# EAGLE design ADXL_ADXRS Breakout Pod RevB (EAGLE 9.6.2)
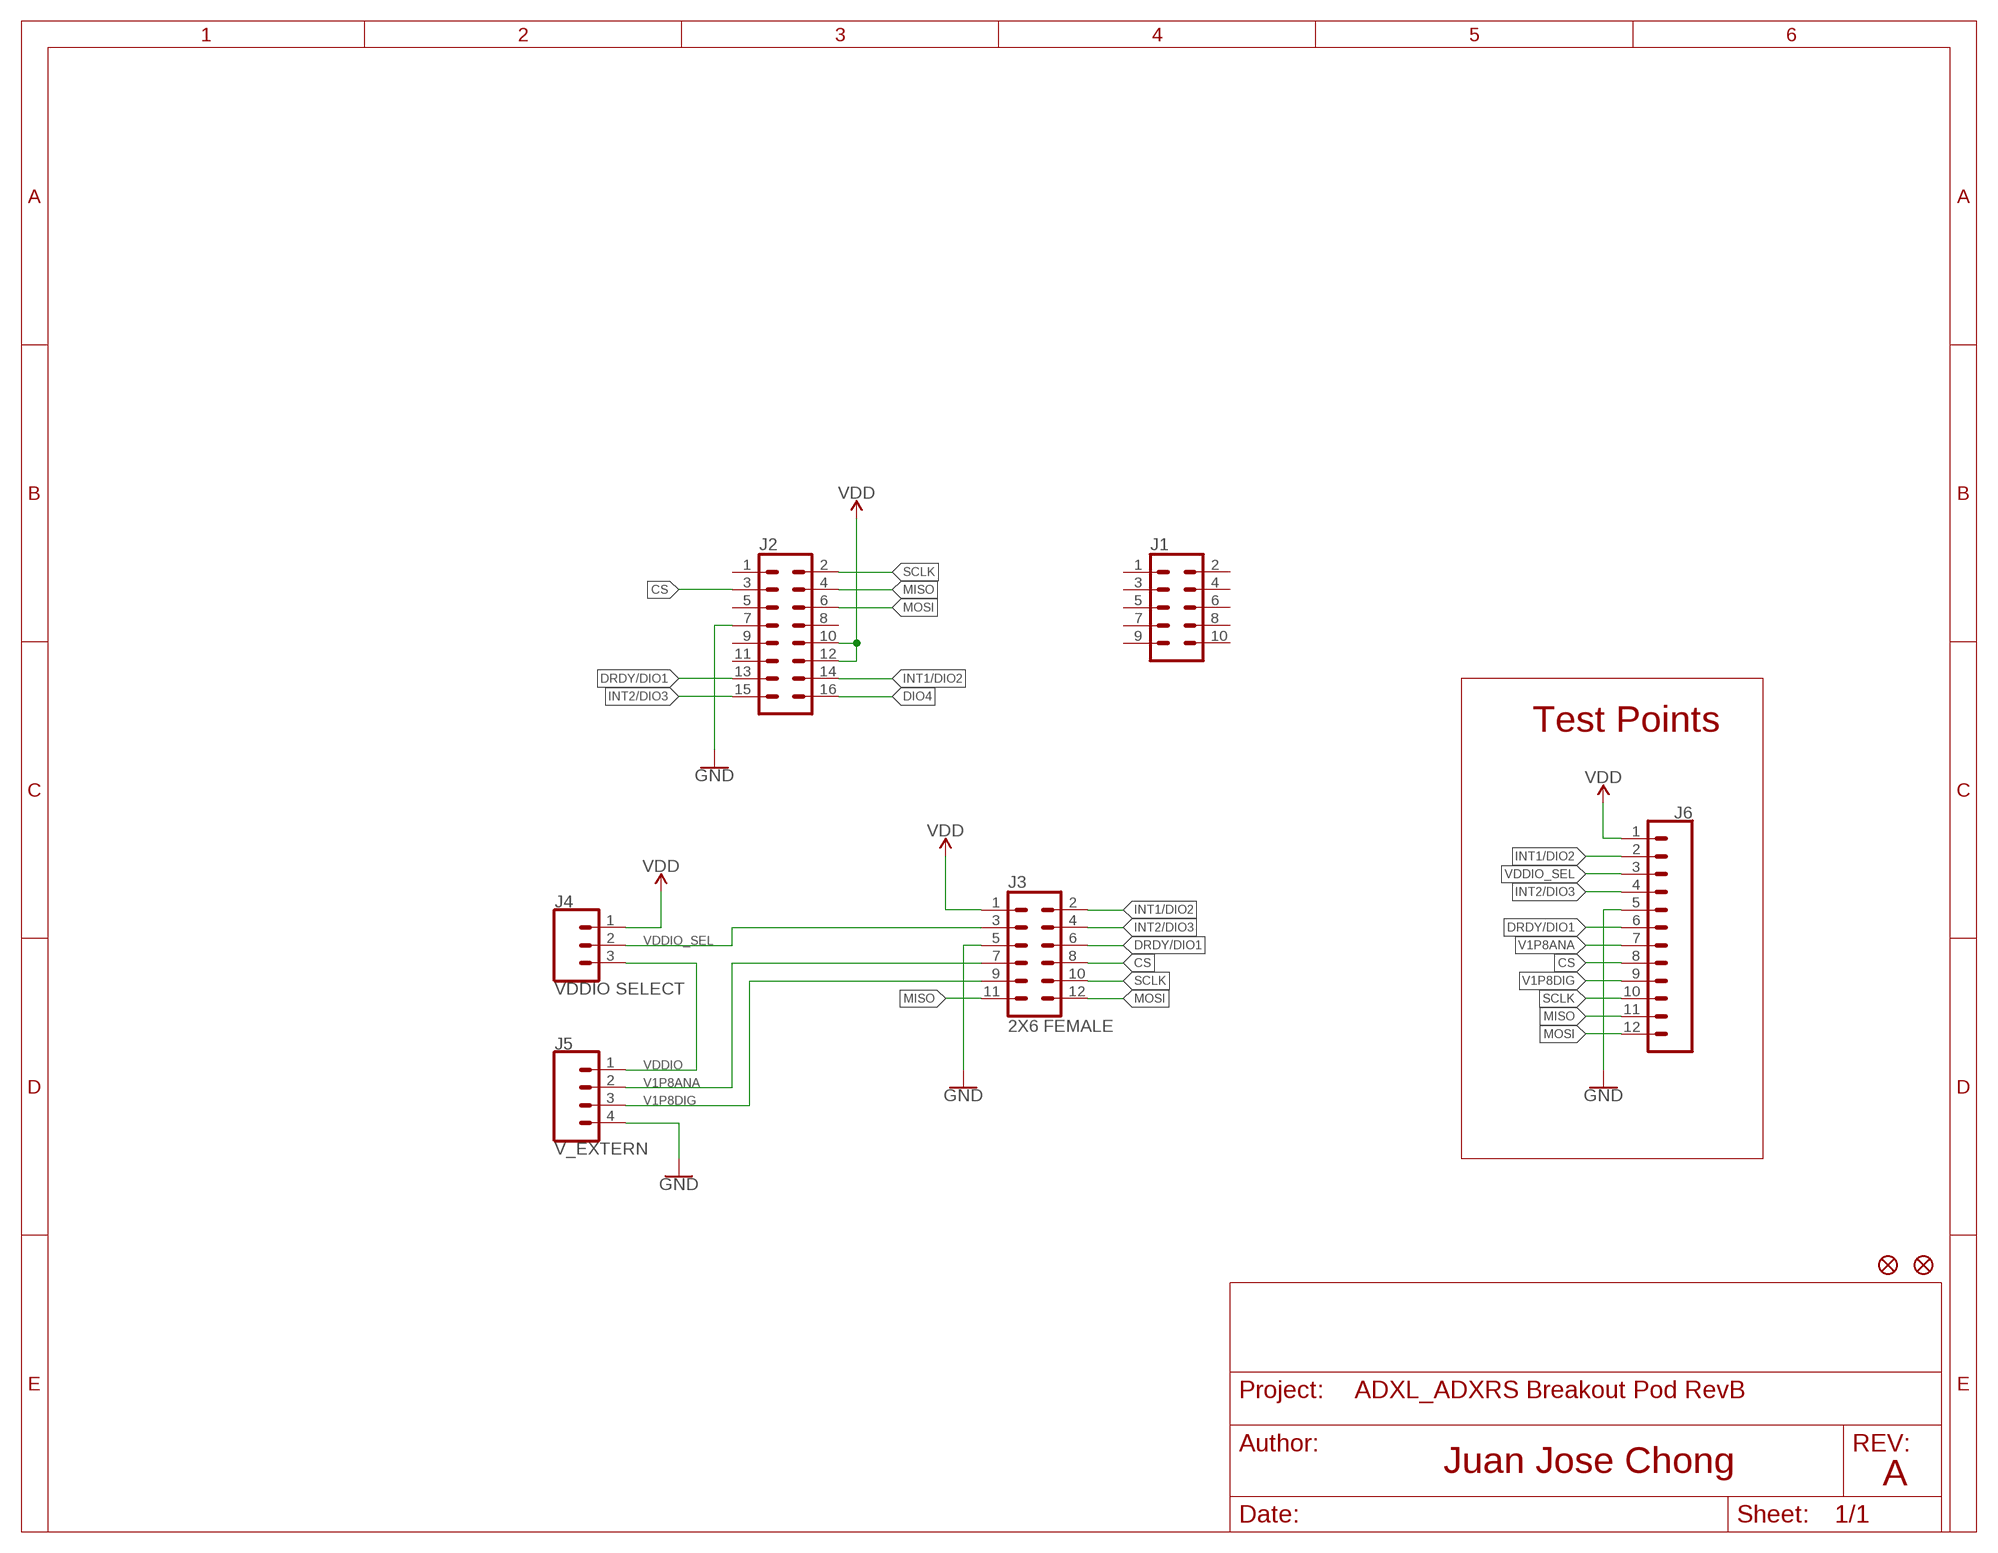
[diagram p0: schematic, sheet 1]

## Parts
FD1  FIDUCIAL1X2  [FIDUCIAL-1X2]
FD2  FIDUCIAL1X2  [FIDUCIAL-1X2]
J1  CONN_05X2_2MM_FEMALE  [M22-6550542R]
J2  CONN_08X2_2MM_FEMALE  [M22-6550842R]
J3  2X6 FEMALE  CONN_06X2PTH_FEMALE  [2X6]
J4  VDDIO SELECT  CONN_03  [1X03]
J5  V_EXTERN  CONN_04PTH  [1X04]
J6  CONN_12  [1X12]

## Nets
CS: J2.3 J3.8 J6.8
DIO4: J2.16
DRDY/DIO1: J2.13 J3.6 J6.6
GND: J2.7 J3.5 J5.4 J6.5
INT1/DIO2: J2.14 J3.2 J6.2
INT2/DIO3: J2.15 J3.4 J6.4
MISO: J2.4 J3.11 J6.11
MOSI: J2.6 J3.12 J6.12
SCLK: J2.2 J3.10 J6.10
V1P8ANA: J3.7 J5.2 J6.7
V1P8DIG: J3.9 J5.3 J6.9
VDD: J2.10 J2.12 J3.1 J4.1 J6.1
VDDIO: J4.3 J5.1
VDDIO_SEL: J3.3 J4.2 J6.3
Unconnected: J1.1 J1.2 J1.3 J1.4 J1.5 J1.6 J1.7 J1.8 J1.9 J1.10 J2.1 J2.5 J2.8 J2.9 J2.11

## Notes on the sheet
- Test Points
- A

## Library data of the parts
FD1 FD2 = SparkFun-Aesthetics:FIDUCIAL: Fiducial Alignment Points Point-of-reference for pick-and-place machines and other optical instruments.
J1 = ADI_iSensors_Misc:CONN_05X2: Multi connection point. Often used as Generic Header-pin footprint for 0.1 inch spaced/style header connections For AVR SPI programming port, see special device with nice symbol: "AVR_SPI_PROG_5x2.dev" You can populate with any combo of single row headers, but if you'd like an exact match, check these: 2x5 AVR ICSP Male Header <https://www.sparkfun.com/products/778> (PRT-00778) 2x5 Pin Shrouded Header <https://www.sparkfun.com/products/8506> (PRT-08506) On any of the 0.1 inch spaced packages, you can populate with these: Break Away Headers - Straight <https://www.sparkfun.com/products/116> (PRT-00116) Break Away Male Headers - Right Angle <https://www.sparkfun.com/products/553> (PRT-00553) Female Headers <https://www.sparkfun.com/products/115> (PRT-00115) Break Away Headers - Machine Pin <https://www.sparkfun.com/products/117> (PRT-00117) Break Away Female Headers - Swiss Machine Pin <https://www.sparkfun.com/products/743> (PRT-00743) Special note: the shrouded connector mates well with our 5x2 ribbon cables: 2x5 Pin IDC Ribbon Cable <https://www.sparkfun.com/products/8535> (PRT-08535)
J2 = ADI_iSensors_Misc:CONN_08X2: Multi connection point. Often used as Generic Header-pin footprint for 0.1 inch spaced/style header connections You can populate with any combo of single row headers, but if you'd like an exact match, check this: Header - 2x8 (Male, 0.1") <https://www.sparkfun.com/products/13156> (PRT-13156) On any of the 0.1 inch spaced packages, you can populate with these: Break Away Headers - Straight <https://www.sparkfun.com/products/116> (PRT-00116) Break Away Male Headers - Right Angle <https://www.sparkfun.com/products/553> (PRT-00553) Female Headers <https://www.sparkfun.com/products/115> (PRT-00115) Break Away Headers - Machine Pin <https://www.sparkfun.com/products/117> (PRT-00117) Break Away Female Headers - Swiss Machine Pin <https://www.sparkfun.com/products/743> (PRT-00743)
J3 = SparkFun-Connectors:CONN_06X2: Multi connection point. Often used as Generic Header-pin footprint for 0.1 inch spaced/style header connections On any of the 0.1 inch spaced packages, you can populate with these: Break Away Headers - Straight <https://www.sparkfun.com/products/116> (PRT-00116) Break Away Male Headers - Right Angle <https://www.sparkfun.com/products/553> (PRT-00553) Female Headers <https://www.sparkfun.com/products/115> (PRT-00115) Break Away Headers - Machine Pin <https://www.sparkfun.com/products/117> (PRT-00117) Break Away Female Headers - Swiss Machine Pin <https://www.sparkfun.com/products/743> (PRT-00743); PROD_ID: CONN-12423
J4 = SparkFun-Connectors:CONN_03: Multi connection point. Often used as Generic Header-pin footprint for 0.1 inch spaced/style header connections On any of the 0.1 inch spaced packages, you can populate with these: Break Away Headers - Straight <https://www.sparkfun.com/products/116> (PRT-00116) Break Away Male Headers - Right Angle <https://www.sparkfun.com/products/553> (PRT-00553) Female Headers <https://www.sparkfun.com/products/115> (PRT-00115) Break Away Headers - Machine Pin <https://www.sparkfun.com/products/117> (PRT-00117) Break Away Female Headers - Swiss Machine Pin <https://www.sparkfun.com/products/743> (PRT-00743) Stackable Header - 3 Pin (Female, 0.1") <https://www.sparkfun.com/products/13875> (PRT-13875) For SCREWTERMINALS and SPRING TERMINALS visit here: Screw Terimnals on SparkFun.com <https://www.sparkfun.com/search/results?term=Screw+Terminals> (5mm/3.5mm/2.54mm spacing) This device is also useful as a general connection point to wire up your design to another part of your project. Our various solder wires solder well into these plated through hole pads. Hook-Up Wire - Assortment (Stranded, 22 AWG) <https://www.sparkfun.com/products/11375> (PRT-11375) Hook-Up Wire - Assortment (Solid Core, 22 AWG) <https://www.sparkfun.com/products/11367> (PRT-11367) View the entire wire category on our website here <https://www.sparkfun.com/categories/141> Special notes: Molex polarized connector foot print use with SKU : PRT-08232 with associated crimp pins and housings.; PROD_ID: XXX-00000; VALUE: 455-1750-1-ND
J5 = SparkFun-Connectors:CONN_04: Multi connection point. Often used as Generic Header-pin footprint for 0.1 inch spaced/style header connections On any of the 0.1 inch spaced packages, you can populate with these: Break Away Headers - Straight <https://www.sparkfun.com/products/116> (PRT-00116) Break Away Male Headers - Right Angle <https://www.sparkfun.com/products/553> (PRT-00553) Female Headers <https://www.sparkfun.com/products/115> (PRT-00115) Break Away Headers - Machine Pin <https://www.sparkfun.com/products/117> (PRT-00117) Break Away Female Headers - Swiss Machine Pin <https://www.sparkfun.com/products/743> (PRT-00743) For SCREWTERMINALS and SPRING TERMINALS visit here: Screw Terimnals on SparkFun.com <https://www.sparkfun.com/search/results?term=Screw+Terminals> (5mm/3.5mm/2.54mm spacing) This device is also useful as a general connection point to wire up your design to another part of your project. Our various solder wires solder well into these plated through hole pads. Hook-Up Wire - Assortment (Stranded, 22 AWG) <https://www.sparkfun.com/products/11375> (PRT-11375) Hook-Up Wire - Assortment (Solid Core, 22 AWG) <https://www.sparkfun.com/products/11367> (PRT-11367) View the entire wire category on our website here <https://www.sparkfun.com/categories/141> Special notes: Molex polarized connector foot print use with SKU : PRT-08231 with associated crimp pins and housings. 1MM SMD Version SKU: PRT-10208; PROD_ID: CONN-09696
J6 = SparkFun-Connectors:CONN_12: Multi connection point. Often used as Generic Header-pin footprint for 0.1 inch spaced/style header connections On any of the 0.1 inch spaced packages, you can populate with these: Break Away Headers - Straight <https://www.sparkfun.com/products/116> (PRT-00116) Break Away Male Headers - Right Angle <https://www.sparkfun.com/products/553> (PRT-00553) Female Headers <https://www.sparkfun.com/products/115> (PRT-00115) Break Away Headers - Machine Pin <https://www.sparkfun.com/products/117> (PRT-00117) Break Away Female Headers - Swiss Machine Pin <https://www.sparkfun.com/products/743> (PRT-00743) For SCREWTERMINALS and SPRING TERMINALS visit here: Screw Terimnals on SparkFun.com <https://www.sparkfun.com/search/results?term=Screw+Terminals> (5mm/3.5mm/2.54mm spacing) This device is also useful as a general connection point to wire up your design to another part of your project. Our various solder wires solder well into these plated through hole pads. Hook-Up Wire - Assortment (Stranded, 22 AWG) <https://www.sparkfun.com/products/11375> (PRT-11375) Hook-Up Wire - Assortment (Solid Core, 22 AWG) <https://www.sparkfun.com/products/11367> (PRT-11367) View the entire wire category on our website here <https://www.sparkfun.com/categories/141> Special notes: Molex polarized connector foot print use with SKU : PRT-08231 with associated crimp pins and housings. 1MM SMD Version SKU: PRT-10208 NOTES ON THE VARIANTS LOCK and LOCK_LONGPADS... This footprint was designed to help hold the alignment of a through-hole component (i.e. 6-pin header) while soldering it into place. You may notice that each hole has been shifted either up or down by 0.005 of an inch from it's more standard position (which is a perfectly straight line). This slight alteration caused the pins (the squares in the middle) to touch the edges of the holes. Because they are alternating, it causes a "brace" to hold the component in place. 0.005 has proven to be the perfect amount of "off-center" position when using our standard breakaway headers. Although looks a little odd when you look at the bare footprint, once you have a header in there, the alteration is very hard to notice. Also,if you push a header all the way into place, it is covered up entirely on the bottom side.

## Board
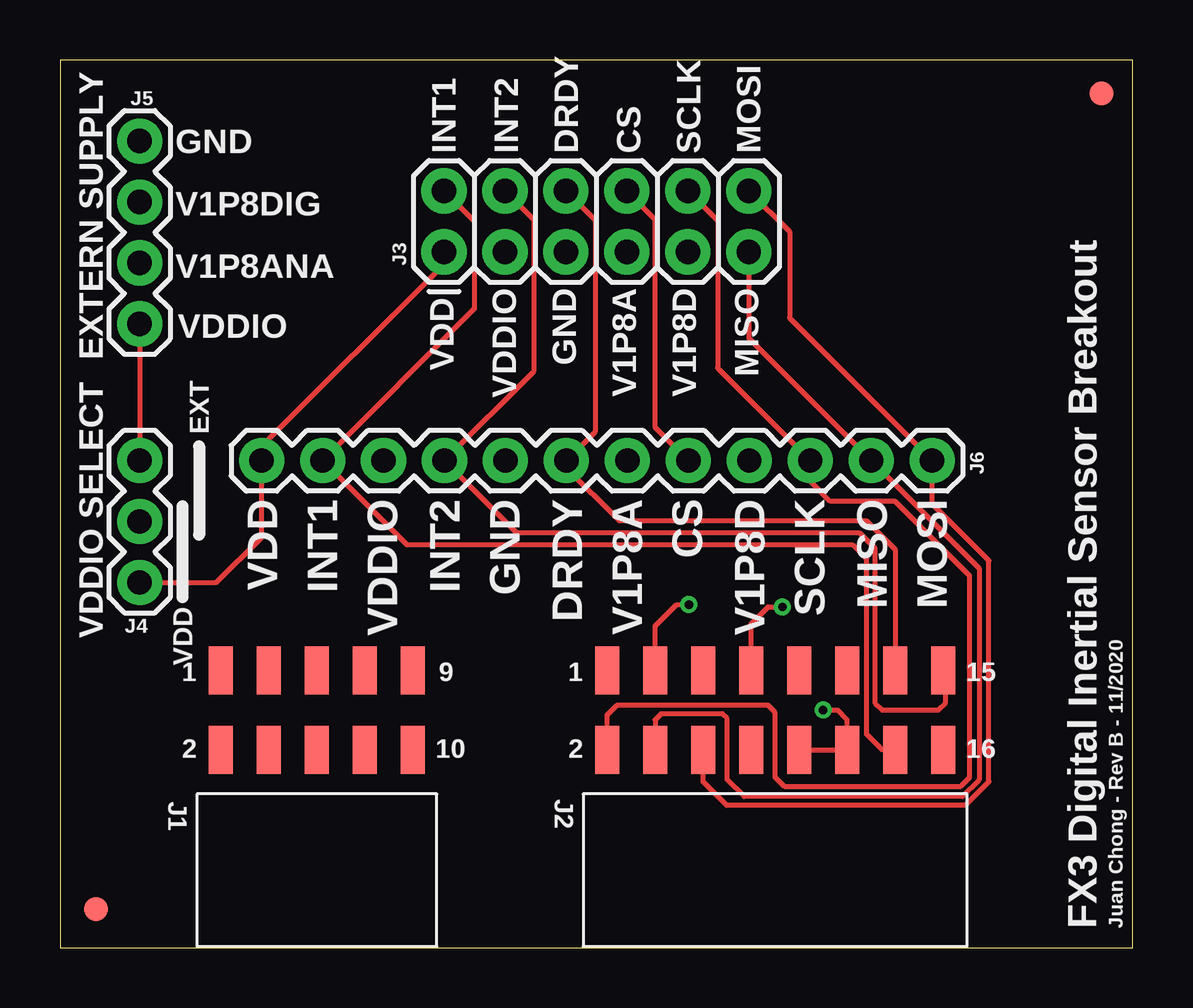
[diagram p1: board, top side]
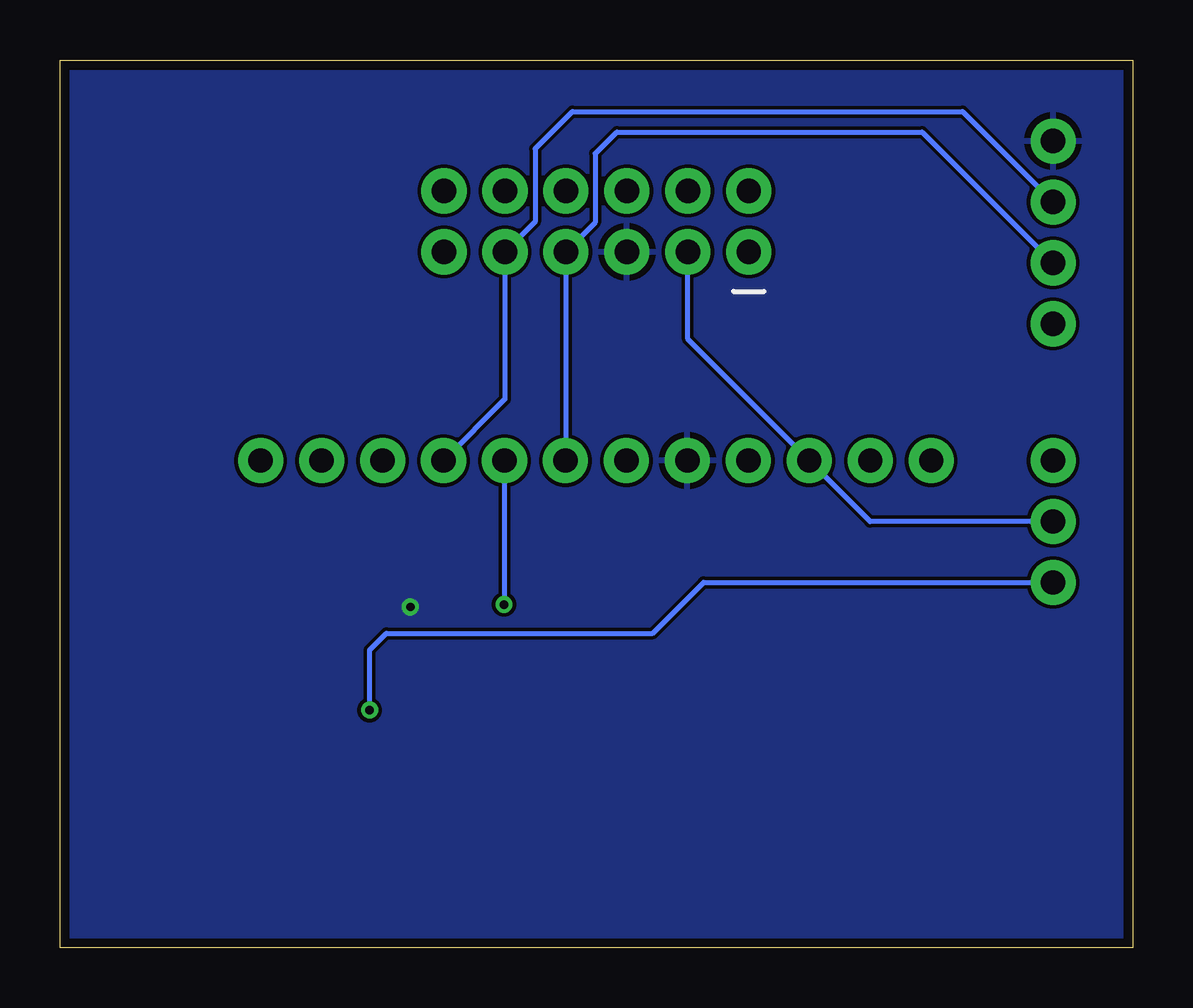
[diagram p2: board, bottom side, seen from below]

Size 44.7 x 37 mm. Coordinates in mm from the lower left corner, seen from the top.
Outline: 0,0 44.7,0 44.7,37 0,37 0,0
Copper layers (1*16): Top 0.0356mm / dielectric 1.5011mm / Bottom 0.0356mm
Design rules "LaenPCBOrder_FilledVias *": minimum track width 6mil, minimum drill 10mil, track to track 6mil, track to pad 6mil, pad to pad 6mil, via to via 6mil, smd to smd 6mil, copper to edge 15mil, drill to drill 6mil, minimum pad ring 7mil, minimum via ring 7mil, stop-mask expansion 4mil, vias tented up to drill 20mil, thermal gap 10mil

### Footprints (pad centres in the part's own frame; a part is rotated, then mirrored left to right if it is on the bottom)
FIDUCIAL-1X2 = smd 1 x 1: 1 0,0
M22-6550542R = smd 1 x 2: 1 4,-1.65; 2 4,1.65; 3 2,-1.65; 4 2,1.65; 5 0,-1.65; 6 0,1.65; 7 -2,-1.65; 8 -2,1.65; 9 -4,-1.65; 10 -4,1.65
M22-6550842R = smd 1 x 2: 1 7,-1.65; 2 7,1.65; 3 5,-1.65; 4 5,1.65; 5 3,-1.65; 6 3,1.65; 7 1,-1.65; 8 1,1.65; 9 -1,-1.65; 10 -1,1.65; 11 -3,-1.65; 12 -3,1.65; 13 -5,-1.65; 14 -5,1.65; 15 -7,-1.65; 16 -7,1.65
2X6 = drill 1.016 pad 1.88: 1 0,0; 2 0,2.54; 3 2.54,0; 4 2.54,2.54; 5 5.08,0; 6 5.08,2.54; 7 7.62,0; 8 7.62,2.54; 9 10.16,0; 10 10.16,2.54; 11 12.7,0; 12 12.7,2.54
1X03 = drill 1.016 pad 1.88: 1 0,0; 2 2.54,0; 3 5.08,0
1X04 = drill 1.016 pad 1.88: 1 0,0; 2 2.54,0; 3 5.08,0; 4 7.62,0
1X12 = drill 1.016 pad 1.88: 1 0,0; 2 2.54,0; 3 5.08,0; 4 7.62,0; 5 10.16,0; 6 12.7,0; 7 15.24,0; 8 17.78,0; 9 20.32,0; 10 22.86,0; 11 25.4,0; 12 27.94,0

### Placement (x,y rotation side)
FD1  1.5,1.6 0 top
FD2  43.4,35.6 0 top
J1  10.7,9.9 180 top
J2  29.8,9.9 180 top
J3  16,29 0 top
J4  3.32,15.22 90 top
J5  3.32,26 90 top
J6  8.4,20.3 0 top

### Tracks (layer width: path | path; a pad name or v marks a point on that pad's centre or on a via)
CS  (via drill 0.35)
  Top 0.2: J6.8 24.81,21.67 24.81,30.35 J3.8 | J2.3 24.8,13.4 25.7,14.3 v26.2,14.3
  Bottom 0.2: J6.8 26.18,14.32 v26.2,14.3
DRDY/DIO1
  Top 0.2: J3.6 22.3,30.32 22.3,21.5 J6.6 21.1,20 23.3,17.8 33.6,17.8 34.8,16.6 J2.13
GND  (via drill 0.35)
  Top 0.2: J2.7 28.8,13.5 29.5,14.2 v30.1,14.2
  Bottom 0.2: v30.1,14.2 29.9,14.4
  pour Bottom: -0.9,-1.1 45.1,-1.1 45.1,36.5 -0.9,36.5
INT1/DIO2
  Top 0.2: J3.2 17.27,30.27 17.27,26.63 J6.2 14.44,16.8 33,16.8 33.6,16.2 33.6,8.9 34.25,8.25 J2.14
INT2/DIO3
  Top 0.2: J3.4 19.73,30.35 19.73,24.01 J6.4 19.02,17.3 33.3,17.3 33.95,16.65 33.95,10.2 34.25,9.9 36.6,9.9 36.9,10.2 36.9,11.45 J2.15
MISO
  Top 0.2: J3.11 28.7,25.4 J6.11 38.3,15.8 38.3,7 37.6,6.3 28.5,6.3 27.8,7 27.8,9.55 27.6,9.75 25.05,9.75 24.8,9.5 J2.4
MOSI
  Top 0.2: J3.12 30.4,29.84 30.4,26.24 J6.12 36.34,18.5 38.71,16.13 38.71,6.91 37.75,5.95 27.75,5.95 26.8,6.9 J2.6
SCLK
  Top 0.2: J3.10 27.4,30.3 27.4,24.16 J6.10 31.26,19.44 32.1,18.6 34.8,18.6 37.9,15.5 37.9,7.1 37.5,6.7 30.2,6.7 29.8,7.1 29.8,9.8 29.5,10.1 23.2,10.1 22.8,9.7 J2.2
V1P8ANA
  Bottom 0.2: J6.7 23.62,20.32 J3.7 22.4,30.22 22.4,33.1 21.5,34 8.78,34 J5.2
V1P8DIG
  Bottom 0.2: J6.9 26.16,22.86 J3.9 24.9,30.26 24.9,33.3 23.35,34.85 7.09,34.85 J5.3
VDD  (via drill 0.35)
  Top 0.2: J4.1 6.52,15.22 8.4,17.1 J6.1 8.4,20.9 16,28.5 J3.1 | J2.10 J2.12 32.8,9.5 32.4,9.9 v31.8,9.9
  Bottom 0.2: v31.8,9.9 31.8,12.4 31.1,13.1 20,13.1 17.88,15.22 J4.1
VDDIO
  Top 0.2: J5.1 3.32,24.82 J4.3
VDDIO_SEL
  Bottom 0.2: J4.2 10.94,17.76 J6.3 18.54,25.36 J3.3

### Text on the board
tNames: GND | INT1 | INT2 | DRDY | CS | SCLK | MOSI | V1P8DIG | V1P8ANA | VDDIO | GND | V1P8A | V1P8D | MISO | VDD | VDDIO | EXTERN SUPPLY | EXT | VDD | INT1 | VDDIO | INT2 | GND | DRDY | V1P8A | CS | V1P8D | SCLK | MISO | MOSI | VDD | VDDIO SELECT | FX3 Digital Inertial Sensor Breakout | Juan Chong - Rev B - 11/2020